# Altium schematic sheet Sheet1.SchDoc
size A; SheetNumber: 1; SheetTotal: 1
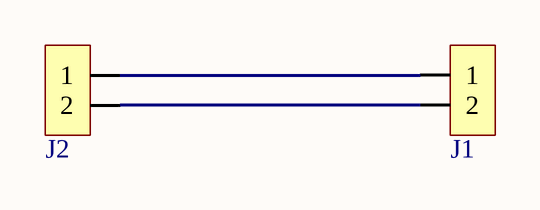
[diagram p0: Sheet1.SchDoc]

## Parts
J1  Header Pins  [HEADER PIN 1x2]  (value not drawn)
J2  Header Pins  [HEADER PIN 1x2]  (value not drawn)

## Nets
NetJ1_1: J1.1 J2.1
NetJ1_2: J1.2 J2.2

## Library data of the parts
J1 J2 = Header Pins 1x2